# EAGLE board octanis_eps_v2 (EAGLE 7.2.0)
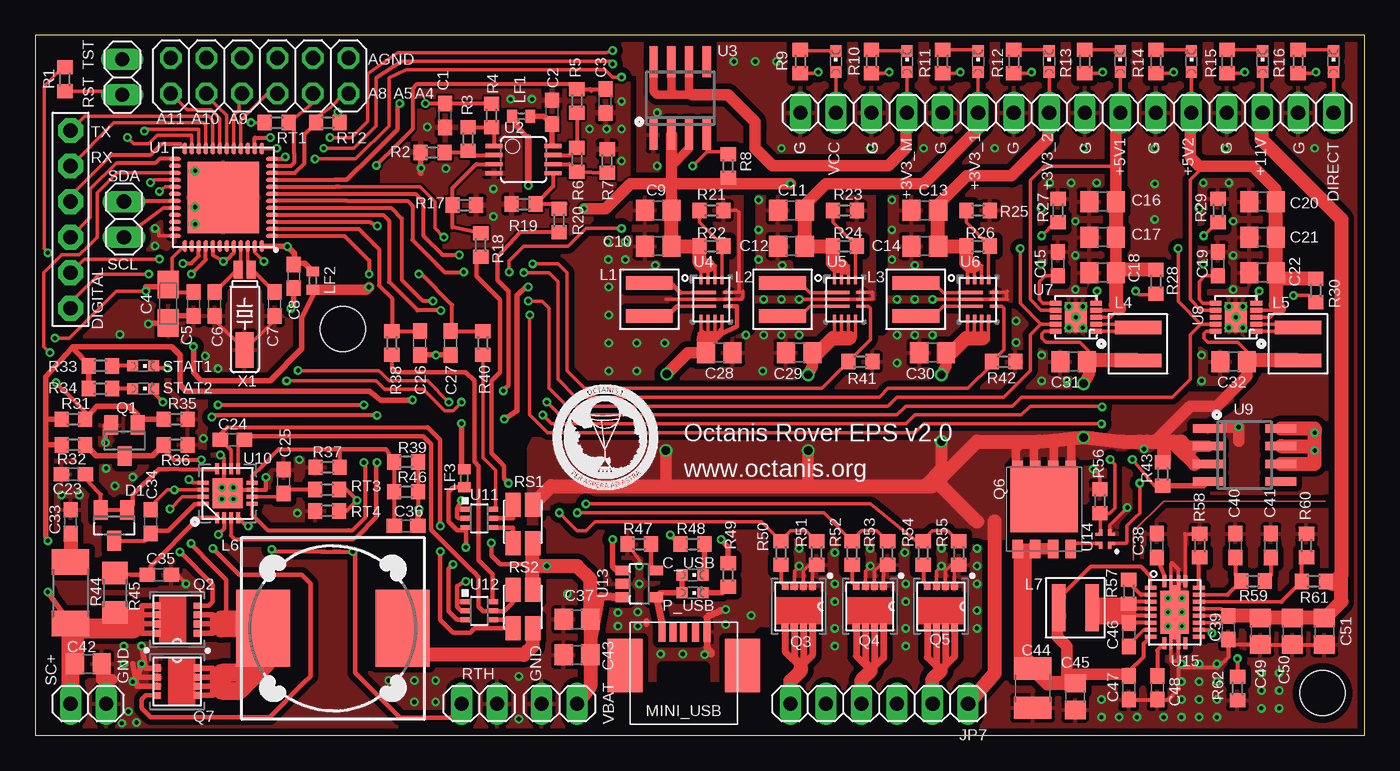
[diagram p2: board, top side]
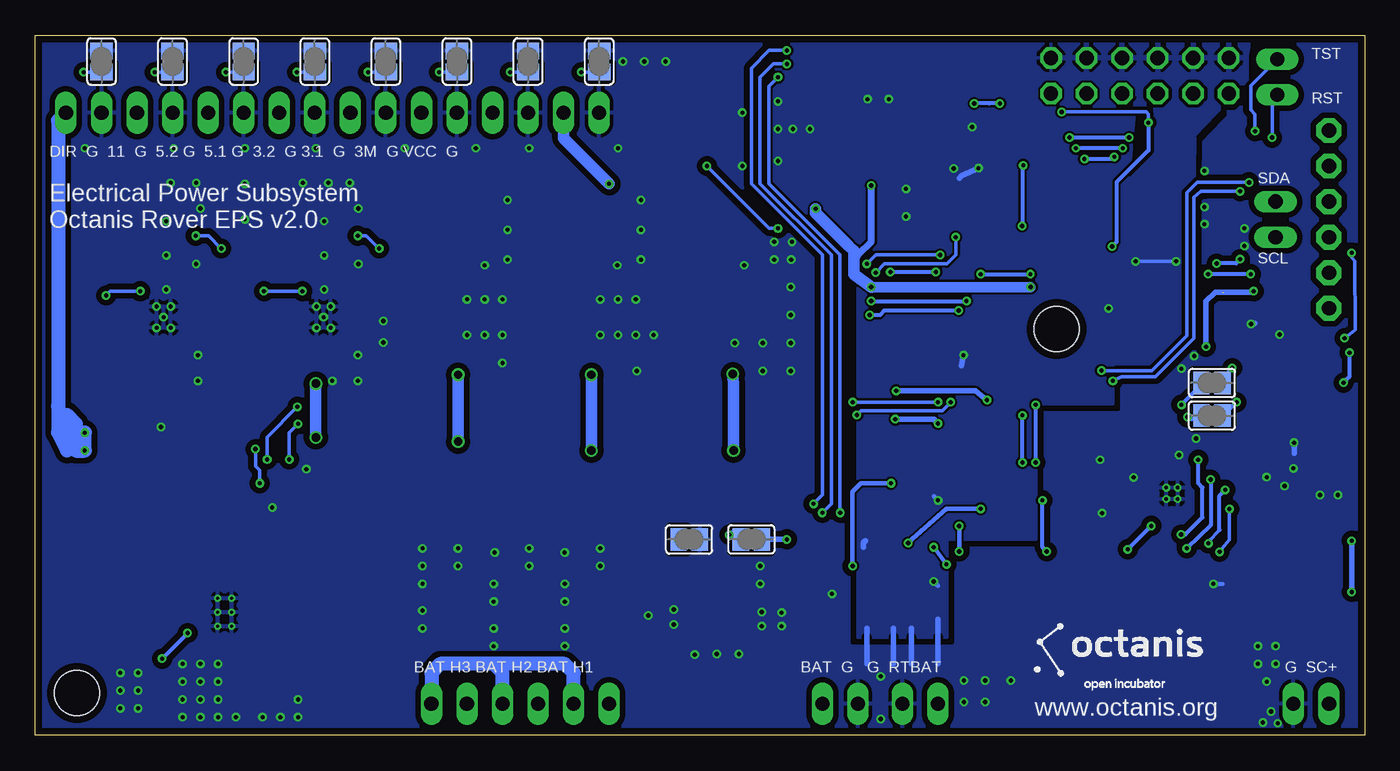
[diagram p3: board, bottom side, seen from below]

Size 95 x 50 mm. Coordinates in mm from the lower left corner, seen from the top.
Outline: 0,0 95,0 95,50 0,50 0,0
Copper layers (1*16): Top 0.035mm / dielectric 1.6mm / Bottom 0.035mm
Design rules "Elecrow_2-layer_PCB_eagle_rule": minimum track width 6mil, minimum drill 12mil, track to track 6mil, track to pad 6mil, pad to pad 6mil, via to via 8mil, smd to smd 0mil, copper to edge 20mil, drill to drill 10mil, minimum pad ring 6mil, minimum via ring 6mil, stop-mask expansion 0mil, vias tented up to drill 100mil, thermal gap 10mil
Net classes: 0 default: clearance 0.152 mm; 1 power: width 0.203 mm, drill 0.305 mm, clearance 0.152 mm; 3 fine: width 0.406 mm, drill 0.61 mm, clearance 0.152 mm
Holes 3.2 mm at 22,29 92,3
tRestrict: 10 lines

## Footprints (pad centres in the part's own frame; a part is rotated, then mirrored left to right if it is on the bottom)
CHIPLED_0603 = smd 0.8 x 0.8: A 0,-0.75; C 0,0.75
C0603 = smd 1.1 x 1: 1 -0.85,0; 2 0.85,0
A/3216-18R = smd 1.95 x 1.5: + 1.375,0; - -1.375,0
C0805 = smd 1.3 x 1.5: 1 -0.95,0; 2 0.95,0
C1210 = smd 1.6 x 2.7: 1 -1.4,0; 2 1.4,0
SOT23 = smd 1 x 1.4: 1 -0.95,-1.1; 2 0.95,-1.1; 3 0,1.1
1X06-BIG = drill 1.016 pad 1.778 octagon: 1 -6.35,0; 2 -3.81,0; 3 -1.27,0; 4 1.27,0; 5 3.81,0; 6 6.35,0
SJ = smd 1.168 x 1.6: 1 -0.762,0; 2 0.762,0
1X02 = drill 1.016 long: 1 -1.27,0; 2 1.27,0
2X06 = drill 1.016 octagon: 1 -6.35,-1.27; 2 -6.35,1.27; 3 -3.81,-1.27; 4 -3.81,1.27; 5 -1.27,-1.27; 6 -1.27,1.27; 7 1.27,-1.27; 8 1.27,1.27; 9 3.81,-1.27; 10 3.81,1.27; 11 6.35,-1.27; 12 6.35,1.27
1X16 = drill 1.016 long: 1 -19.05,0; 2 -16.51,0; 3 -13.97,0; 4 -11.43,0; 5 -8.89,0; 6 -6.35,0; 7 -3.81,0; 8 -1.27,0; 9 1.27,0; 10 3.81,0; 11 6.35,0; 12 8.89,0; 13 11.43,0; 14 13.97,0; 15 16.51,0; 16 19.05,0
1X06 = drill 1.016 long: 1 -6.35,0; 2 -3.81,0; 3 -1.27,0; 4 1.27,0; 5 3.81,0; 6 6.35,0
XFL4020 = smd 0.965 x 3.353: P$1 -1.181,0; P$2 1.181,0
DR127 = smd 3.85 x 5.5: 1 -4.975,0; 2 4.975,0
0402 = smd 0.7 x 0.9: 1 -0.65,0; 2 0.65,0
UX60SC-MB-5ST = smd 1.4 x 0.5: 1 6.1,1.55; 2 6.1,0.75; 3 6.1,0; 4 6.1,-0.85; 5 6.1,-1.65 | smd 3.8 x 2.5: M3 3.7,4.2; M4 3.7,-4.2
DQG8 = smd 0.559 x 0.508: 1 -1.47,0.975; 2 -1.47,0.325; 3 -1.47,-0.325; 5 1.47,-0.975; 6 1.47,-0.325; 7 1.47,0.325; 8 1.47,0.975 | smd 0.559 x 0.457: 4 -1.47,-0.975
PG-TDSON-8 = smd 1.3 x 0.75: 1 -2.825,1.905; 2 -2.825,0.635; 3 -2.825,-0.635; 4 -2.825,-1.905; 5 2.825,-1.905; 6 2.825,-0.635; 7 2.825,0.635; 8 2.825,1.905 | smd 4.7 x 4.8: TH 0.725,0
R0603 = smd 1 x 1.1: 1 -0.85,0; 2 0.85,0
R2010 = smd 1.8 x 2.7: 1 -2.2,0; 2 2.2,0
R1206 = smd 1.6 x 1.803: 1 -1.422,0; 2 1.422,0
4PADS_RESISTOR = smd 1.727 x 1.1: I1 0,0; I2 2.751,0; V1 0,1.4; V2 2.751,1.4
S-PVQFN-N48 = smd 0.85 x 0.28: 1 -3.475,2.75; 2 -3.475,2.25; 3 -3.475,1.75; 4 -3.475,1.25; 5 -3.475,0.75; 6 -3.475,0.25; 7 -3.475,-0.25; 8 -3.475,-0.75; 9 -3.475,-1.25; 10 -3.475,-1.75; 11 -3.475,-2.25; 12 -3.475,-2.75; 25 3.475,-2.75; 26 3.475,-2.25; 27 3.475,-1.75; 28 3.475,-1.25; 29 3.475,-0.75; 30 3.475,-0.25; 31 3.475,0.25; 32 3.475,0.75; 33 3.475,1.25; 34 3.475,1.75; 35 3.475,2.25; 36 3.475,2.75 | smd 0.28 x 0.85: 13 -2.75,-3.475; 14 -2.25,-3.475; 15 -1.75,-3.475; 16 -1.25,-3.475; 17 -0.75,-3.475; 18 -0.25,-3.475; 19 0.25,-3.475; 20 0.75,-3.475; 21 1.25,-3.475; 22 1.75,-3.475; 23 2.25,-3.475; 24 2.75,-3.475; 37 2.75,3.475; 38 2.25,3.475; 39 1.75,3.475; 40 1.25,3.475; 41 0.75,3.475; 42 0.25,3.475; 43 -0.25,3.475; 44 -0.75,3.475; 45 -1.25,3.475; 46 -1.75,3.475; 47 -2.25,3.475; 48 -2.75,3.475 | smd 5.1 x 5.1: VSS_QFN 0,0
MSOP08 = smd 0.3 x 1.2: 1 -0.976,-2.113; 2 -0.326,-2.113; 3 0.324,-2.113; 4 0.974,-2.113; 5 0.974,2.112; 6 0.324,2.112; 7 -0.326,2.112; 8 -0.976,2.112
SO8 = smd 0.6 x 2.2: 1 -1.905,-2.6; 2 -0.635,-2.6; 3 0.635,-2.6; 4 1.905,-2.6; 5 1.905,2.6; 6 0.635,2.6; 7 -0.635,2.6; 8 -1.905,2.6
RNC0014A = smd 1.778 x 0.229: 1 -0.555,0.49; 2 -0.555,0; 3 -0.555,-0.49 | smd 0.229 x 0.61: 4 -0.75,-1.4; 5 -0.25,-1.4; 6 0.25,-1.4; 7 0.75,-1.4; 11 0.75,1.4; 12 0.25,1.4; 13 -0.25,1.4; 14 -0.75,1.4 | smd 0.61 x 0.229: 8 1.15,-0.5; 9 1.15,0; 10 1.15,0.5
S-PVSON-N10 = smd 0.28 x 0.825: 1 -1,-1.462; 2 -0.5,-1.462; 3 0,-1.462; 4 0.5,-1.462; 5 1,-1.462; 6 1,1.462; 7 0.5,1.462; 8 0,1.462; 9 -0.5,1.462; 10 -1,1.462 | smd 2.15 x 1.6: EXPAD 0,0 | drill 0.3 pad 0.605: GND1 -0.762,0.508 | drill 0.3 pad 0.61: GND2 -0.762,-0.508; GND3 0,0; GND4 0.762,-0.508 | drill 0.305 pad 0.605: GND5 0.762,0.508
RVA16_2P14X2P14 = smd 0.787 x 0.279: 1 -1.75,0.75; 2 -1.75,0.25; 3 -1.75,-0.25; 4 -1.75,-0.75; 9 1.75,-0.75; 10 1.75,-0.25; 11 1.75,0.25; 12 1.75,0.75 | smd 0.279 x 0.787: 5 -0.75,-1.75; 6 -0.25,-1.75; 7 0.25,-1.75; 8 0.75,-1.75; 13 0.75,1.75; 14 0.25,1.75; 15 -0.25,1.75; 16 -0.75,1.75 | smd 2.134 x 2.134: 17 0,0 | drill 0.254: V -0.406,-0.406; V_1 -0.406,0.406; V_2 0.406,-0.406; V_3 0.406,0.406
SC70-6 = smd 0.35 x 0.8: 1 -0.65,-0.95; 2 0,-0.95; 3 0.65,-0.95; 4 0.65,0.95; 5 0,0.95; 6 -0.65,0.95
SOT23-5 = smd 0.7 x 1: 1 0.95,1.2; 2 0,1.2; 3 -0.95,1.2; 4 -0.95,-1.2; 5 0.95,-1.2
QFN-4 = smd 0.23 x 0.49: P1 -0.325,0.45; P2 -0.325,-0.45; P3 0.325,-0.45; P4 0.325,0.45 | smd 0.49 x 0.23: P$1 -0.45,0.325; P$2 -0.45,-0.325; P$3 0.45,-0.325; P$4 0.45,0.325
R-PVQFN-N20 = smd 0.85 x 0.28: P$1 0,0; P$10 4.45,0; P$11 4.45,1.5; P$20 0,1.5 | smd 0.28 x 0.85: P$2 0.475,-0.975; P$3 0.975,-0.975; P$4 1.475,-0.975; P$5 1.975,-0.975; P$6 2.475,-0.975; P$7 2.975,-0.975; P$8 3.475,-0.975; P$9 3.975,-0.975; P$12 3.975,2.475; P$13 3.475,2.475; P$14 2.975,2.475; P$15 2.475,2.475; P$16 1.975,2.475; P$17 1.475,2.475; P$18 0.975,2.475; P$19 0.475,2.475 | smd 3.05 x 2.05: PGND1 2.225,0.75 | smd 1.15 x 0.23: PGND2 0.15,1.025; PGND3 0.15,0.475; PGND4 4.3,0.475; PGND5 4.3,1.025 | smd 3.85 x 0.78: PGND6 2.225,0.75 | drill 0.2 pad 0.4: PGND7 2.225,0.25; PGND8 1.225,0.25; PGND9 1.225,1.25; PGND10 2.225,1.25; PGND11 3.225,0.25; PGND12 3.225,1.25
MS3V-T1R = smd 0.635 x 1.27: P1 -0.47,-4.43; P2 0.47,-4.43 | smd 1.27 x 2.54: P3 0,1.3

## Placement (x,y rotation side)
+3V3_1  3V3-1  [CHIPLED_0603]  67.39,48.11 0 top
+3V3_2  3V3-2  [CHIPLED_0603]  72.47,48.11 0 top
+3V3_M  3V3-M  [CHIPLED_0603]  62.31,48.11 0 top
+5V1  5V1  [CHIPLED_0603]  77.55,48.11 0 top
+5V2  5V2  [CHIPLED_0603]  82.63,48.11 0 top
+11V  11V  [CHIPLED_0603]  87.71,48.11 0 top
C1  1.5uF  [C0603]  29.3,44.26 90 top
C2  100nF  [C0603]  36.93,44.49 270 top
C3  1.5uF  [C0603]  40.75,45.29 90 top
C4  10uF  [A/3216-18R]  9.52,30.8 90 top
C5  100nF  [C0603]  11.33,30.78 270 top
C6  12pF  [C0603]  12.85,30.78 90 top
C7  12pF  [C0603]  17.12,30.78 90 top
C8  100nF  [C0603]  18.49,32.77 270 top
C9  22uF  [C0805]  44.53,37.47 180 top
C10  22uF  [C0805]  44.53,34.92 180 top
C11  22uF  [C0805]  54.05,37.47 180 top
C12  22uF  [C0805]  54.05,34.92 180 top
C13  22uF  [C0805]  63.58,37.47 180 top
C14  22uF  [C0805]  63.58,34.92 180 top
C15  10nF  [C0603]  73.11,33.66 90 top
C16  22uF  [C0805]  76.28,38.1 180 top
C17  22uF  [C0805]  76.28,35.56 180 top
C18  22uF  [C0805]  76.28,33.02 180 top
C19  10nF  [C0603]  84.53,33.66 90 top
C20  22uF  [C0805]  87.71,38.1 180 top
C21  22uF  [C0805]  87.71,35.56 180 top
C22  22uF  [C0805]  87.71,33.02 180 top
C23  1uF  [C0603]  2.74,18.62 180 top
C24  100nF  [C0603]  14.11,21.09 180 top
C25  1uF  [C0603]  17.76,18.1 90 top
C26  1.5uF  [C0603]  27.5,28 90 top
C27  1.5uF  [C0603]  29.7,28 90 top
C28  10uF  [C0805]  48.9,27.3 0 top
C29  10uF  [C0805]  54.61,27.3 180 top
C30  10uF  [C0805]  64.14,27.3 180 top
C31  22uF  [C0805]  74.22,26.67 180 top
C32  22uF  [C0805]  85.64,26.67 180 top
C33  2.2uF  [C0603]  2.54,15.24 90 top
C34  100nF  [C0603]  8.26,15.24 270 top
C35  1uF  [C0603]  8.89,11.43 0 top
C36  22pF  [C0603]  26.52,14.94 180 top
C37  10uF  [C0805]  38.73,8.26 180 top
C38  2.2uF  [C0603]  80.17,13.53 90 top
C39  1uF  [C0603]  85.27,7.66 90 top
C40  150pF  [C0603]  85.77,13.53 90 top
C41  4.7nF  [C0603]  88.31,13.53 90 top
C42  10uF  [C0805]  3.81,5.08 180 top
C43  10uF  [C0805]  38.73,5.71 180 top
C44  47uF Tantal  [C1210]  71.29,3.35 270 top
C45  10uF  [C0805]  74.34,2.74 270 top
C46  100nF  [C0603]  78.15,7.16 270 top
C47  100nF  [C0603]  78.15,3.37 270 top
C48  47nF  [C0603]  80.19,3.37 270 top
C49  22uF  [C0805]  87.56,7.41 90 top
C50  22uF  [C0805]  89.85,7.41 90 top
C51  22uF  [C0805]  92.14,7.41 90 top
C_USB  C_USB  [CHIPLED_0603]  46.99,11.43 270 top
D1  BAT54C  [SOT23]  5.66,14.98 180 top
DIGITAL  [1X06-BIG]  2.54,36.83 90 top
DIRECT  DIRECT  [CHIPLED_0603]  92.79,48.11 0 top
J100  [SJ]  48.26,13.97 0 bottom
J101  [SJ]  43.81,13.97 180 bottom
J102  [SJ]  10.9,22.81 0 bottom
J103  [SJ]  10.9,25.15 0 bottom
J104  [SJ]  90.25,48.11 270 bottom
J105  [SJ]  85.17,48.11 270 bottom
J106  [SJ]  80.09,48.11 270 bottom
J107  [SJ]  75.01,48.11 270 bottom
J108  [SJ]  69.93,48.11 270 bottom
J109  [SJ]  64.85,48.11 270 bottom
J110  [SJ]  59.77,48.11 270 bottom
J111  [SJ]  54.69,48.11 270 bottom
JP1  [1X02]  6.23,47 90 top
JP2  [2X06]  16.05,47.09 0 top
JP3  [1X16]  73.74,44.45 0 top
JP4  [1X02]  6.35,36.83 270 top
JP5  [1X02]  3.81,2.24 180 top
JP6  [1X02]  37.47,2.24 0 top
JP7  [1X06]  60.33,2.24 180 top
L1  1uH  [XFL4020]  43.9,31.11 90 top
L2  1uH  [XFL4020]  53.42,31.11 90 top
L3  1uH  [XFL4020]  62.95,31.11 90 top
L4  1uH  [XFL4020]  78.82,27.94 90 top
L5  1uH  [XFL4020]  90.25,27.94 90 top
L6  DR127_6u8  [DR127]  21.29,7.62 0 top
L7  1.5uH  [XFL4020]  74.34,9.09 0 top
LF1  100mH  [0402]  34.75,44.2 180 top
LF2  100mH  [0402]  19.86,32.46 270 top
LF3  100mH  [0402]  30.68,18.34 90 top
MINI_USB  UX60SC-MB-5ST  [UX60SC-MB-5ST]  46.35,1.27 90 top
P_USB  P_USB  [CHIPLED_0603]  46.99,10.16 270 top
Q1  BSS123  [SOT23]  6.4,21.03 180 top
Q2  CSD16327Q3_DQG_8  [DQG8]  10.16,8.26 180 top
Q3  CSD16327Q3_DQG_8  [DQG8]  54.58,9.19 270 top
Q4  CSD16327Q3_DQG_8  [DQG8]  59.66,9.19 270 top
Q5  CSD16327Q3_DQG_8  [DQG8]  64.73,9.19 270 top
Q6  BSC0901NS  [PG-TDSON-8]  72.11,16.11 90 top
Q7  CSD16327Q3_DQG_8  [DQG8]  10.16,3.81 0 top
R1  10k  [R0603]  2.13,46.83 90 top
R2  200k (0.1%)  [R0603]  28.41,41.61 180 top
R3  100k (0.1%)  [R0603]  30.95,42.57 270 top
R4  1k  [R0603]  32.62,44.26 270 top
R5  1k  [R0603]  38.72,45.29 270 top
R6  100k (0.1%)  [R0603]  38.72,41.1 270 top
R7  330k (0.1%)  [R0603]  40.89,41 90 top
R8  1M  [R0603]  49.53,40.64 270 top
R9  1k  [R0603]  54.69,48.11 90 top
R10  1k  [R0603]  59.77,48.11 90 top
R11  1k  [R0603]  64.85,48.11 90 top
R12  1k  [R0603]  69.93,48.11 90 top
R13  1.5k  [R0603]  75.01,48.11 90 top
R14  1.5k  [R0603]  80.09,48.11 90 top
R15  4.7k  [R0603]  85.17,48.11 90 top
R16  1.5k  [R0603]  90.25,48.11 90 top
R17  100k (0.1%)  [R0603]  30.67,37.85 180 top
R18  200k (0.1%)  [R0603]  31.85,35 270 top
R19  100k (0.1%)  [R0603]  34.91,37.92 0 top
R20  330k (0.1%)  [R0603]  37.45,36.75 270 top
R21  150k  [R0603]  48.34,37.47 180 top
R22  360k  [R0603]  48.34,34.92 180 top
R23  150k  [R0603]  57.87,37.47 180 top
R24  360k  [R0603]  57.87,34.92 180 top
R25  150k  [R0603]  67.39,37.47 180 top
R26  360k  [R0603]  67.39,34.92 180 top
R27  1M  [R0603]  73.11,37.47 270 top
R28  1M  [R0603]  80.09,32.38 90 top
R29  1M  [R0603]  84.53,37.47 270 top
R30  1M  [R0603]  91.52,31.75 90 top
R31  dnp  [R0603]  2.74,22.56 180 top
R32  Rmpph  [R0603]  2.74,20.73 180 top
R33  4k7  [R0603]  4.67,26.37 180 top
R34  4k7  [R0603]  4.67,24.74 180 top
R35  1M  [R0603]  10.06,22.56 180 top
R36  Rmppl  [R0603]  10.06,20.73 180 top
R37  100k (1%)  [R0603]  20.9,19.12 0 top
R38  1k  [R0603]  25.5,28 270 top
R39  100k (1%)  [R0603]  26.52,19.51 0 top
R40  1k  [R0603]  32,28 270 top
R41  1M  [R0603]  58.98,26.67 0 top
R42  1M  [R0603]  69.22,26.67 0 top
R43  1M  [R0603]  80.57,18.64 90 top
R44  2  [R2010]  2.54,10.16 270 top
R45  10  [R1206]  5.71,10.16 90 top
R46  2.2M (1%)  [R0603]  26.52,17.37 0 top
R47  2k  [R0603]  43.18,13.64 180 top
R48  470  [R0603]  46.99,13.64 180 top
R49  1k  [R0603]  49.53,11.43 90 top
R50  1k  [R0603]  53.3,13 90 top
R51  1M  [R0603]  55.84,13 270 top
R52  1k  [R0603]  58.38,13 90 top
R53  1M  [R0603]  60.92,13 270 top
R54  1k  [R0603]  63.47,13 90 top
R55  1M  [R0603]  66,13 270 top
R56  1M  [R0603]  76.09,16.71 270 top
R57  47k  [R0603]  78.15,10.24 270 top
R58  100k  [R0603]  83.23,13.53 270 top
R59  150-220k  [R0603]  87.04,10.99 180 top
R60  56k  [R0603]  90.85,13.53 270 top
R61  430k  [R0603]  91.37,10.97 0 top
R62  dnp  [R0603]  85.92,3.32 270 top
RS1  10m  [4PADS_RESISTOR]  35.56,13.7 90 top
RS2  10m  [4PADS_RESISTOR]  35.56,7.62 90 top
RT1  2723  [R0603]  17.27,43.74 0 top
RT2  2723  [R0603]  20.93,43.74 180 top
RT3  2696  [R0603]  20.88,17.53 0 top
RT4  8187  [R0603]  20.88,16 180 top
RTH  103AT  [1X02]  31.75,2.24 180 top
STAT1  5V-ok  [CHIPLED_0603]  7.73,26.37 270 top
STAT2  5V-ok  [CHIPLED_0603]  7.73,24.74 270 top
U1  MSP430FR5969  [S-PVQFN-N48]  13.46,38.4 180 top
U2  OPA2333DGK  [MSOP08]  34.91,41.1 270 top
U3  TPS2022D  [SO8]  46.1,45.49 0 top
U4  Value  [RNC0014A]  48.34,31.11 0 top
U5  Value  [RNC0014A]  57.87,31.11 0 top
U6  Value  [RNC0014A]  67.39,31.11 0 top
U7  TPS61232  [S-PVSON-N10]  74.38,29.84 90 top
U8  TPS61232  [S-PVSON-N10]  85.81,29.84 90 top
U9  TPS2022D  [SO8]  86.42,20 270 top
U10  BQ24650_RVA_16  [RVA16_2P14X2P14]  13.76,17.26 90 top
U11  INA213  [SC70-6]  31.75,15.47 270 top
U12  INA213  [SC70-6]  31.75,8.87 270 top
U13  MCP73831/2  [SOT23-5]  43.18,10.79 90 top
U14  MIC5019  [QFN-4]  76.46,14.01 180 top
U15  TPS61088  [R-PVQFN-N20]  80.69,10.99 270 top
VCC  3V3-EPS  [CHIPLED_0603]  57.23,48.11 0 top
X1  32.768kHz  [MS3V-T1R]  14.99,28.8 180 top

## Tracks (layer width: path | path; a pad name or v marks a point on that pad's centre or on a via)
+3V3  (via drill 0.3)  (1 unrouted)
  Top 0.254: R1.2 1.97,47.69 0.66,46.33 0.66,34.75 v0.91,34.44 | v1.42,28.35 2.44,28.35 4.57,30.48 5.79,31.7 v7.92,31.7 | C9.1 C10.1 46.99,34.92 | R22.2 46.99,34.92 | 47.59,33.66 U4.14 47.59,33.42 47.7,33.53 | 47.59,33.66 47.59,34.33 46.99,34.92 | 47.59,33.66 48.09,33.16 U4.13 48.09,33.53 48.4,33.31 48.5,33.2 48.59,33.2 | 47.59,33.66 48.26,33.66 48.59,33.33 U4.12 48.59,33.2 | VCC.A JP3.2 | U1.37 10.65,34.93 9.8,34.09 9.8,32.45 C4.+ 9.35,32 | 10.06,31.64 | 10.06,31.64 10.01,31.64 | 10.06,31.64 | 10.06,31.64 9.96,31.64 | 10.06,31.64 | 48.59,33.2 48.59,33.5 48.62,33.53
  Top 0.3: v35.25,32 35.1,32 | 9.99,31.71 10.06,31.64 C5.1
  Top 0.406: LF2.2 20.93,31.81 21.54,31.83 21.54,31.75 20.03,31.73 | 35.25,42.67 35.2,42.67 34.44,43.43 34.44,43.85 LF1.2 | 20.37,31.7 20.03,31.73 | v11.33,27.74 11.33,25.86 11.89,25.3 14.94,25.3 16.79,25.3 19.07,27.57 19.07,29.76 20.03,31.73 | v7.92,31.7 7.92,32 9.35,32 | v35.25,32 35.05,32 34.44,31.39 34.44,23.47 | 34.44,23.47 34.44,23.16 | 34.44,23.16 34.44,23.47 | v30.48,22.25 30.48,20.12 30.48,19.09 LF3.2 | 34.44,23.47 34.44,23.16 | 34.44,23.16 v33.53,22.55
  Top 0.5: v35.25,39.25 35.25,42.67
  Top 0.61: U3.3 46.73,41.9 45.48,40.64
  Top 0.75: v23.86,32 23.68,31.81 20.93,31.81 LF2.2
  Top 0.813: C9.1 45.48,39.37 | 45.48,39.37 45.48,40.64 45.48,42.24 U3.2 | v39.22,37.59 40.77,37.59 42.55,39.37 45.48,39.37 | v53.98,39.37 49.53,39.37 | 49.53,39.37 45.48,39.37 | R8.2 49.53,39.37
  Top 1.016: 48.09,33.53 47.7,33.53 47.49,33.74 R22.2 C10.1 C9.1
  Bottom 0.254: v0.91,34.44 0.91,34.14 0.71,33.83 0.66,28.96 v1.42,28.35 | 10.67,31.64 10.11,31.64
  Bottom 0.406: v11.33,27.74 11.33,30.97 10.67,31.64 10.11,31.64 7.99,31.64 v7.92,31.7 | v30.48,22.25 30.79,22.55 v33.53,22.55
  Bottom 0.5: 35.25,35.25 v35.25,39.25
  Bottom 0.508: 35.25,35.25 35.25,35.23 36.2,34.29 36.5,33.66
  Bottom 0.75: v23.86,32 33.66,32 v35.25,32
  Bottom 0.813: v53.98,39.37 57.23,42.62 JP3.2 | v39.22,37.59 39.22,37.31 36.83,34.92 36.5,34.59 36.5,33.66 36.5,32.91 v35.25,32
+3V3_1
  Top 0.254: 57.15,33.66 57.62,33.19 U5.13 57.62,33.02 | 57.15,33.66 57.12,33.62 U5.14 57.12,33.42 57.23,33.53 | 57.15,33.66 57.78,33.66 58.12,33.33 U5.12 58.12,33.2 | 57.15,33.66 57.15,34.79 R24.2 C12.1 C11.1 | +3V3_1.A JP3.6 | 57.62,33.02 57.62,33.53 57.92,33.31 | 58.12,33.2 58.12,33.5 58.14,33.53 | 58.12,33.2 57.94,33.02 57.62,33.02
  Top 0.813: JP3.6 67.31,44.37 67.31,43.81 | 67.31,43.81 67.31,43.18 | C11.1 55.01,37.86 56.52,39.37 57.15,39.37 63.5,39.37 67.31,43.18 | 67.31,43.18 67.31,43.81
  Top 1.016: 57.62,33.53 57.23,33.53 57.02,33.74 R24.2 C12.1 C11.1
+3V3_2
  Top 0.254: U6.14 66.64,33.42 66.75,33.53 | U6.13 67.14,33.53 67.44,33.31 67.53,33.31 67.64,33.2 | U6.12 67.64,33.2 | 67.64,33.2 67.64,33.5 67.67,33.53 | +3V3_2.A JP3.8
  Top 0.813: JP3.8 72.39,44.37 72.39,42.55 69.77,39.93 66.6,39.93 64.53,37.86 C13.1
  Top 1.016: 67.14,33.53 66.75,33.53 66.54,33.74 R26.2 C14.1 C13.1
+3V3_M
  Top 0.254: +3V3_M.A JP3.4
  Top 0.61: U3.8 44.2,45.98 44.45,45.72 45.72,45.72 | 45.72,45.72 46.99,45.72 46.73,45.98 U3.6 | U3.7 45.47,45.98 45.72,45.72
  Top 0.813: 46.99,45.72 49.53,45.72 51.44,43.81 51.44,43.18 51.44,41.91 52.68,40.66 58.45,40.66 60.98,40.66 62.23,41.91 62.23,44.37 JP3.4
+5V_1
  Top 0.254: U7.3 76.83,29.84 77.47,30.48 77.33,30.34 U7.4 | U7.7 71.89,30.34 71.12,31.11 71.12,39.62 72.11,40.62 77.23,40.62 | +5V1.A JP3.10
  Top 0.813: JP3.10 77.23,44.13 77.23,40.62 C16.1 C17.1 C18.1
  Top 1.016: 77.47,30.48 77.23,30.72 C18.1 77.44,33.23 R28.2 | C16.1 C17.1
+5V_2
  Top 0.254: U8.3 88.27,29.84 88.9,30.48 88.77,30.34 U8.4 | U8.7 83.32,30.34 82.55,31.11 82.55,39.67 83.5,40.63 | +5V2.A 82.63,43.9 82.55,43.81
  Top 0.813: JP3.12 82.55,44.37 82.55,43.81 82.55,41.27 83.21,40.62 | 83.21,40.62 83.5,40.63 83.21,40.62 | 83.21,40.62 87.02,40.62 88.66,38.98 C20.1
  Top 1.016: C22.1 88.66,30.72 88.9,30.48 | C22.1 C21.1 C20.1 | R30.2 89.08,32.6 C22.1
+12V
  Top 0.25: U15.P$16 84.76,9.02 | U15.P$14 84.77,8.02 | U15.P$15 C39.2
  Top 0.254: +11V.A JP3.14
  Top 0.3: 84.76,9.02 C39.2 | 84.77,8.02 C39.2 | C39.2
  Top 1: C51.2 C50.2 C49.2 87.41,8.51 C39.2
  Top 1.016: JP3.14 87.63,44.37 87.63,42.55 93.34,36.83 93.34,11.43 | 93.34,11.43 92.71,10.79 92.53,10.97 R61.2 | 93.34,11.43 93.34,9.53 92.22,8.4 92.18,8.36 C51.2
A_EXT0
  Top 0.25: 22.1,45.82 21.08,44.81 20.08,44.11 RT2.2
  Top 0.254: JP2.11 22.1,45.82
  Top 0.3: U1.10 17.5,40.16 18.57,40.16 19.25,40.84 19.25,41.45 19.25,42.91 RT2.2
A_EXT1
  Top 0.25: 19.86,45.17 18.52,44.07 RT1.2
  Top 0.254: 19.86,45.17 JP2.9
  Top 0.3: 18.52,44.07 18.52,41.48 18.52,40.88 18.34,40.69 18.3,40.66 U1.11
A_EXT2
  Top 0.254: U1.16 14.71,43.92 15.42,44.63 16.61,45.82 JP2.7
A_EXT3
  Top 0.254: U1.17 14.21,44.26 14.58,44.63 14.58,45.62 JP2.5
A_EXT4
  Top 0.254: U1.18 13.71,44.25 13.11,44.86 12.24,45.72 JP2.3
A_EXT5
  Top 0.254: U1.19 13.21,44.04 12.6,44.65 10.87,44.65 JP2.1
AGND  (via drill 0.3)
  Top 0.25: U1.47 15.71,34.48 16.05,34.14 v16.36,33.83
  Top 0.3: U1.41 12.71,34.28 v13.46,33.83 13.31,33.98 13.77,33.98 14.21,34.43 U1.44
  Top 0.305: U11.2 30.25,15.47 30.18,15.54 30.18,16.15 | 30.77,16.15 U11.1 30.21,16.12 30.18,16.15 | 30.18,16.15 v30.48,16.76 | U12.2 30.75,8.87 30.45,8.87 30.18,9.14 30.18,9.45 30.25,9.52 | v30.79,10.97 30.19,10.65 30.18,10.64 30.18,10.06 30.18,9.52 30.25,9.52 | 30.25,9.52 U12.1
  Top 0.406: C8.2 18.49,30.79 v18.29,30.48 | C27.1 28.83,27.15 v28.65,27.13 28.78,27.15 C26.1 | R2.2 27.56,40.13 v27.58,40.49
  Bottom 0.25: v16.36,33.83 13.92,33.83 v13.46,33.83
  Bottom 0.305: v30.48,16.76 30.79,17.07 | v30.79,10.97 30.48,10.67
  Bottom 0.406: 35.81,13.41 35.81,13.72 35.66,13.87 | v28.65,27.13 28.8,26.36 | v27.58,40.49 28.8,39.93 28.96,39.78 | 30.48,6.99 30.48,7.62 30.48,8.26 | 32.38,7.62 32.38,6.99 | 33.66,7.62 33.66,6.99 | 35.56,7.62 35.56,6.99
  other vias: 29.36,40.46 28.04,43.43 33.99,45.42 41.91,45.26 41.91,43.28 41.91,41 35.51,45.42 32.77,39.01 32.77,37.03 39.62,43.28 40.84,43.28
  pour Bottom (isolate 0.254): 12.42,29.03 17.75,24.16 17.88,40.84 21.49,45.72 21.49,49.68 8.23,49.68 8.43,48.62 8.43,46.79 12.22,42.85 12.19,42.57
  pour Bottom: 18.03,34.14 24.54,34.14 36.2,34.92 36.2,6.99 29.84,6.99 29.84,13.97 23.5,13.97 23.5,23.67 17.98,23.67
  pour Bottom: 17.42,33.22 35.97,33.22 42.21,39.62 42.21,49.07 41.61,49.68 16,49.68 17.27,34.59 17.88,33.99
  pour Top: 24.84,47.85 24.84,39.01 28.96,34.9 37.8,34.9 42.37,39.47 42.37,49.07 42.06,49.38 26.21,49.38 24.84,48.01
AVCC  (via drill 0.3)
  Top 0.25: RT1.1 v15.44,43.74 | U1.48 16.39,34.9 | RT2.1 21.64,44.26 v21.64,44.5
  Top 0.406: LF2.1 19.82,33.11 19.25,33.68 18.56,33.68 | 18.56,33.68 C8.1 | 18.56,33.68 18.56,34.38 v18.03,34.9 16.39,34.9
  Bottom 0.25: v21.64,44.5 21.69,44.5 15.6,44.5 15.44,44.35 v15.44,43.74
  Bottom 0.3: v15.44,43.74 15.44,41.76 17.73,39.47 17.73,35.2 v18.03,34.9
AVCC1  (via drill 0.3)
  Top 0.305: v30.79,13.41 30.8,13.73 U11.3 30.61,14.63 30.18,14.63 29.57,15.24 29.57,17.37 29.88,17.69 LF3.1 | v29.87,12.19 29.57,11.89 29.57,8.84 30.18,8.23 U12.3
  Bottom 0.305: v30.79,13.41 v29.87,12.19
AVCC2
  Top 0.406: LF1.1 36.38,44.2 C2.2 36.93,42.16 U2.8
BAT+  (via drill 0.3)
  Top 0.3: R18.2 31.55,33.85 | R39.2 R46.2 27.39,15.59 C36.1
  Top 0.305: 31.55,33.85 31.55,32.77 33.22,31.09 33.22,25.91 32.61,25.3 32.61,20.12 33.22,19.51 33.53,19.2 33.53,18.29 v33.83,17.98 | v36.58,12.06 35.69,12.06 35.56,12.19 | 35.26,12.19 33.22,12.19 32.61,12.8 v32.61,13.72
  Top 0.406: C36.1 27.39,15.59 v27.43,16.15 | 35.26,12.19 35.56,11.89
  Top 0.61: U13.3 40.46,9.9 C43.1
  Top 1.016: RS2.I2 35.56,11.89 35.56,12.06 | 35.56,12.06 35.56,12.19 RS1.I1 | 35.56,12.06 v36.58,12.06 38.73,12.06 39.69,11.12 C37.1 C43.1 39.69,3.49 JP6.2
  Bottom 0.305: v33.83,17.98 35.97,17.98 36.58,17.37 v36.58,12.06 | v27.43,16.15 29.87,16.15 v32.61,13.72
BAT_11V
  Top 0.3: C47.1 78.15,4.54 79.22,5.61 79.22,6.52 U15.P$9 | U15.P$2 79.71,11.36 79.06,12.01 75.41,12.01 73.27,9.87 | 73.27,8.57 L7.P$1
  Top 0.75: Q6.1 Q6.2 | Q6.2 Q6.3 Q6.2
  Top 0.813: 78.05,4.32 74.34,4.32 C45.1 | 73.07,8.26 73.07,8.36 73.07,9.67 73.27,9.87 | 73.07,8.26 73.07,7.02 73.74,6.35 73.74,3.69 | 73.27,8.57 73.27,8.46 73.07,8.26 | Q6.3 71.16,13.29 70.56,12.7
  Top 1: C45.1 73.74,3.69 72.35,3.69 C44.1 | 78.05,4.32 C47.1
  Top 1.27: 70.56,12.7 70.56,5.47 C44.1
BAT_OUT  (via drill 0.3, 0.6)
  Top 0.25: U14.P$1 U14.P1
  Top 0.254: 57,28.65 57.12,28.77 U5.4 57.12,28.38 57.15,28.35 | 57.61,28.65 57.62,28.66 U5.5 57.62,28.52 57.78,28.35 | U5.6 58.12,28.75 58.22,28.04 | 48.77,28.35 49.07,28.65 49.09,28.67 U4.7 49.09,29.07 48.69,28.68 48.59,28.75 U4.6 48.59,28.78 | U5.7 58.62,28.44 58.22,28.04 | 47.9,28.65 47.59,28.96 U4.4 47.59,28.77 47.47,28.65 | 48.03,28.6 48.09,28.66 U4.5 48.09,28.66 48.08,28.65 | 67.51,28.5 67.67,28.65 67.64,28.68 U6.6 67.64,28.75 67.74,28.04 | 67.51,28.5 67.36,28.35 67.14,28.57 | 67.51,28.5 67.97,28.04 68.14,28.21 U6.7 68.14,28.44 67.74,28.04 | U6.5 67.14,28.57 | U6.4 66.64,28.54 66.45,28.35 | 66.45,28.35 66.92,28.35 67.14,28.57 | 66.45,28.35 66.13,28.35 C30.1 | 58.22,28.35 58.22,28.04 | U14.P$1 77.39,13.68 78,13.68 78.03,13.72 78.03,14.94 78.64,15.54 | 75.25,26.76 75.25,27.46 74.68,28.04 72.24,28.04 71.93,28.35 71.93,28.65 72.13,28.84 U7.10 | 86.68,26.76 86.56,26.88 86.56,27.43 85.95,28.04 83.82,28.04 83.52,28.35 83.52,28.65 83.71,28.84 U8.10 | 78.64,15.54 78.94,15.85 | v79.25,20.42 79.25,20.65 78.94,20.95 | v78.94,17.98 78.94,15.85 | 78.94,15.85 78.64,15.54 | U9.3 82.87,19.36 | U6.4 66.64,28.77 66.52,28.65 | U6.5 67.14,28.66 67.13,28.65 | U6.4 66.64,28.46 66.33,28.16 | U6.5 67.14,28.43 67.06,28.35 | 67.74,28.04 67.74,28.27 67.67,28.35
  Top 0.305: 47.59,28.35 47.9,27.74 47.9,27.66 C28.1 48.09,27.45 48.09,28.35 47.9,28.54 47.9,28.65 48.03,28.6 48.5,28.44 | 48.59,28.78 48.46,28.65 48.46,28.47 48.5,28.44 | 49.09,28.67 49.07,28.65 | 49.07,28.65 48.77,28.35 | 48.77,28.35 48.5,28.44 | U4.8 50.16,30.61 50.16,30.48 50.16,29.21 48.9,28.57 49.07,28.65 | 49.07,28.65 48.77,28.35 | 47.78,28.35 47.47,28.65 | 48.09,28.66 48.09,28.41 48.16,28.35 | 48.36,28.35 48.69,28.68
  Top 0.406: 74.07,19.34 74.01,19.29 Q6.5 | 72.8,19.34 72.74,19.29 Q6.6 | 71.37,19.04 Q6.7
  Top 0.61: 71.75,20.95 70.64,20.95 70.1,20.42 70.1,19.04 Q6.8 | 74.07,20.73 74.07,19.34 | 72.8,20.73 72.8,19.34 | 71.37,20.42 71.37,19.04
  Top 0.813: v45.09,20.32 45.09,17.78 | C29.1 55.56,26.35 v55.24,25.73 | v55.24,20.32 55.24,17.78 | C30.1 65.08,26.35 v64.77,25.73 | v64.77,20.95 64.77,19.05 63.5,17.78 | C31.1 75.33,25.8 v74.93,25.09 | v74.93,21.26 71.75,20.95 | C32.1 86.59,25.64 86.36,25.4 84.45,23.5 82.55,23.5 80.01,20.95 | 47.9,28.04 47.9,27.74 | U9.2 82.23,20.63 81.92,20.32 | C28.1 46.66,27.3 v45.14,25.78
  Top 1.016: RS1.I2 36.89,17.78 45.09,17.78 55.24,17.78 63.5,17.78 64.14,17.78 67.31,20.95 71.75,20.95 v74.93,21.26 77.72,20.95 78.94,20.95 79.45,20.95 80.01,20.95 80.64,20.95 | 67.31,15.24 64.77,17.78 | 80.64,20.95 81.28,20.95 | 81.28,20.95 81.92,20.95 82.55,20.32 | 82.87,19.36 81.92,20.32 81.28,20.95 | 80.64,20.95 80.64,19.57 R43.2 | C29.1 55.96,27.3 57,28.35 57.15,28.35 57.78,28.35 58.22,28.35 | L4.P$1 75.25,26.76 C31.1 | L5.P$1 86.68,26.76 C32.1 | 68.58,15.24 68.58,4.45 JP7.1 | C28.1 47.78,28.35 48.16,28.35 48.36,28.35 | 65.48,27.3 66.33,28.16 66.52,28.35 67.06,28.35 67.67,28.35 67.74,28.35
  Bottom 0.254: v79.25,20.42 79.25,19.2 78.94,18.9 78.94,18.29 v78.94,17.98
  Bottom 0.813: v45.14,25.78 45.11,25.78 45.09,24.84 v45.09,20.32 | v55.24,25.73 v55.24,20.32 | v64.77,25.73 v64.77,20.95 | v74.93,25.09 v74.93,21.26
  Bottom 1.016: JP7.3 61.59,4.45 62.23,5.08 | JP7.5 56.52,4.45 57.15,5.08 62.23,5.08 | 62.23,5.08 66.04,5.08 66.67,4.45 JP7.1
  pour Top (isolate 0.406): 35.56,14.61 35.56,20.42 37.27,24.13 85.45,24.13 69.29,14.3
DIRECT  (via drill 0.3)
  Top 0.254: DIRECT.A JP3.16
  Top 1.016: U9.6 91.44,19.36 v91.44,21.59 | U9.7 91.44,20.63 v91.44,21.59 | U9.8 91.44,21.9 v91.44,21.59
  Bottom 1.016: JP3.16 93.34,43.9 93.34,23.5 93.34,21.59 92.71,20.32 92.71,22.86 92.08,22.23 92.08,20.32 v91.44,20.32 v91.44,21.59
EN_3V3_1  (via drill 0.3)
  Top 0.254: 36.2,33.66 v35.56,33.66 36.2,33.66 | 36.2,33.66 37.37,33.66 38.01,33.02 38.01,26.04 39.27,24.77 42.55,24.77 56.22,24.77 R41.1 59.69,28.23 59.69,30.48 59.55,30.61 U5.8
  Top 0.3: U1.7 23.57,38.66 27.18,38.66 27.74,38.1 27.74,35.66 29.11,34.29 v30.33,34.29
  Bottom 0.254: v30.33,34.29 34.29,34.29 34.92,34.29 v35.56,33.66
EN_3V3_2  (via drill 0.3)
  Top 0.254: 21.78,39.16 27.52,39.16 28.57,38.1 28.57,36.2 v29.21,35.56 | v34.92,33.02 36.47,33.02 36.73,33.02 37.37,32.38 37.37,25.4 38.64,24.13 60.33,24.13 60.96,24.77 66.67,24.77 68.36,26.45 R42.1 69.22,27.52 69.22,30.48 69.08,30.61 U6.8
  Top 0.3: U1.8 21.49,39.16 21.78,39.16
  Bottom 0.254: v29.21,35.56 29.21,34.29 29.84,33.66 33.66,33.66 34.29,33.66 v34.92,33.02
EN_3V3_M  (via drill 0.3)
  Top 0.254: v33.88,33.07 33.88,33.88 34.92,34.92 38.1,34.92 39.37,36.2 40.64,36.2 v41.91,36.2 | v46.99,40.64 47.62,41.27 48.01,41.66 | 48.01,41.66 U3.4 | R8.1 49.37,41.66 48.01,41.66
  Top 0.3: U1.6 22.36,38.16 26.46,38.16 26.61,38.16 26.98,37.8 26.98,35.36 29.26,33.07 v30.63,33.07
  Bottom 0.254: v41.91,36.2 42.55,36.2 v46.99,40.64
  Bottom 0.3: v30.63,33.07 v33.88,33.07
EN_5V_1  (via drill 0.3)
  Top 0.254: U7.9 71.89,29.34 | 71.89,29.34 71.12,28.57 71.12,26.04 69.22,24.13 61.59,24.13 60.96,23.5 38.01,23.5 36.73,24.77 36.73,30.48 36.22,31 v35.25,31 | R27.2 72.89,36.62 v71.93,35.66 | v70.41,34.75 70.41,30.83 71.89,29.34
  Top 0.3: U1.5 25.44,37.66 26.21,36.88 26.21,32.52 27.74,31 v28.44,31
  Bottom 0.254: v71.93,35.66 71.32,35.66 v70.41,34.75
  Bottom 0.3: v35.25,31 v28.44,31
EN_5V_2  (via drill 0.3)
  Top 0.254: U8.9 83.32,29.34 | 83.32,29.34 82.55,28.57 82.55,25.4 81.92,24.77 81.28,24.13 70.48,24.13 69.85,23.5 62.23,23.5 61.59,22.86 37.8,22.86 37.49,22.86 v36.58,23.77 | U1.29 9.31,39.16 v8.89,38.84 | v17.98,25.3 24.38,25.3 24.99,24.69 27.74,24.69 29.26,23.16 29.87,23.16 v30.48,23.77 | R29.2 84.47,36.62 v83.52,35.66 | v81.69,34.75 81.69,30.98 83.32,29.34
  Bottom 0.254: v8.89,38.84 11.38,38.84 11.71,38.84 12.19,38.41 12.19,28.35 14.94,25.6 17.37,25.6 v17.98,25.3 | v30.48,23.77 v36.58,23.77 | v83.52,35.66 82.6,35.66 v81.69,34.75
EN_12V  (via drill 0.3)
  Top 0.25: U14.P$3 U14.P3
  Top 0.254: v76.83,19.68 77.17,19.36 77.17,16.2 76.82,15.86 R56.2 76.14,15.81 U14.P3 | v76.2,22.23 63.5,22.23 62.87,21.59 37.47,21.59 36.63,21.59 35.36,22.86 35.36,29.7 v35.36,30
  Top 0.3: U1.4 20.75,37.16 24.87,37.16 25.3,36.73 25.3,32.36 27.33,30.33 v29.01,30.33
  Bottom 0.254: v76.83,19.68 76.83,21.59 v76.2,22.23
  Bottom 0.3: v35.36,30 34.62,30 34.29,30.33 v29.01,30.33
EN_DIRECT  (via drill 0.3)
  Top 0.254: R43.1 80,17.79 v78.41,19.68 | v76.25,23.44 76.22,23.47 76.2,23.5 71.12,23.5 70.48,22.86 62.87,22.86 62.23,22.23 37.47,22.23 36.91,22.23 36.88,22.25 v36.27,22.86 | U1.28 8.54,39.66 v8.26,39.47 | v18.8,26.04 24.56,26.04 24.69,25.91 25.3,25.3 28.04,25.3 v29.57,23.77
  Top 0.406: U9.4 83.52,17.79 R43.1
  Bottom 0.254: v78.41,19.68 78.41,21.29 v76.25,23.44 | v8.26,39.47 11.43,39.47 11.96,39.47 12.7,38.73 12.7,28.52 15.19,26.04 v18.8,26.04 | v29.57,23.77 30.18,23.16 35.97,23.16 v36.27,22.86
EN_HEAT1  (via drill 0.3)
  Top 0.254: v37.47,15.88 38.1,15.24 38.73,14.61 39.37,14.61 40.01,15.24 51.91,15.24 | 51.44,15.24 51.91,15.24 | 51.91,15.24 51.99,15.16 | 51.99,15.16 R50.2 53.3,13.94 53.98,14.61 55.09,14.61 R51.1 | 51.91,15.24 51.99,15.16 | v20.02,41.15 22.91,41.15 25.3,43.54 25.3,46.94 26.52,47.52 39.93,47.52 40.74,47.52 41.27,46.99 v41.91,46.99
  Top 0.3: U1.12 17.88,41.16 v17.88,41.3
  Bottom 0.254: v37.47,15.88 37.47,17.78 37.47,31.75 37.47,34.29 42.55,39.37 42.55,46.35 v41.91,46.99
  Bottom 0.3: v20.02,41.15 18.03,41.15 v17.88,41.3
EN_HEAT2  (via drill 0.3)
  Top 0.254: v41.27,47.93 41.07,48.13 26.21,48.13 24.38,46.94 24.38,43.54 22.76,41.91 v20.62,41.91 | v38.73,15.88 56.36,15.88 R52.2 58.38,13.94 59.05,14.61 60.17,14.61 R53.1
  Top 0.3: U1.13 16.21,41.91 v17.27,41.91
  Bottom 0.254: v38.73,15.88 38.1,16.51 38.1,19.05 38.1,34.29 43.18,39.37 43.18,46.99 42.24,47.93 v41.27,47.93
  Bottom 0.3: v17.27,41.91 v20.62,41.91
EN_HEAT3  (via drill 0.3)
  Top 0.254: v39.37,16.51 40.01,16.51 59.69,16.51 62.99,13.85 R54.2 63.47,13.94 64.14,14.61 65.25,14.61 R55.1 | v41.27,48.9 40.79,48.74 25.91,48.74 23.77,47.24 23.77,43.84 22.61,42.67 v21.08,42.67
  Top 0.3: U1.14 15.71,42.67 v16.82,42.67
  Bottom 0.254: v39.37,16.51 38.73,17.14 38.73,19.05 38.73,34.29 43.81,39.37 43.81,46.99 43.81,47.62 42.55,48.9 v41.27,48.9
  Bottom 0.3: v16.82,42.67 v21.08,42.67
EN_SC  (via drill 0.3)
  Top 0.254: U1.27 5.87,40.16 4.45,38.73 4.45,35.56 3.81,34.92 3.17,34.29 1.91,34.29 0.64,33.02 0.64,27.74 v1.07,27.3
  Top 0.3: v1.5,25.17 3.05,23.62 3.59,23.08 R31.1 | 4.51,23.47 4.42,23.47
  Top 0.406: R31.1 4.42,23.47 | 4.51,23.47 4.72,23.47 6.71,23.47 7.35,22.82 Q1.1 7.78,22.55 R35.2
  Bottom 0.254: v1.07,27.3 1.07,26.67
  Bottom 0.3: v1.5,25.17 1.22,25.45 1.07,25.6 1.07,26.67 v1.07,27.3
GND  (via drill 0.3)
  Top 0.25: U10.11 13.51,19.74 | U15.PGND4 81.16,5.38 | U15.PGND5 81.71,5.33 | 81.86,10.99 U15.P$20 82.19,14.34 | U15.PGND3 81.16,12.21 | U15.PGND2 81.71,11.83 | 12.49,38.35 12.69,38.36 U1.VSS_QFN
  Top 0.254: U1.36 8.85,35.66 8.84,35.66 8.84,36.14 v8.59,36.2 | C7.1 17.12,29.64 X1.P3 12.85,29.64 C6.1 | v64.14,31.11 U6.2 U6.9 68.58,31.11 | 69.47,31.11 69.49,31.09 | U6.10 69.41,31.61 | 69.41,31.61 69.49,31.7 | v54.61,31.11 U5.2 59.87,31.11 | U5.9 59.87,31.11 | U5.10 59.83,31.61 59.87,31.11 | U4.10 50.29,31.61 | 50.29,31.61 50.51,31.61 50.6,31.7 50.6,31.32 50.49,31.11 U4.9 U4.2 45.09,31.11 | v78.05,16.25 76.79,14.99 U14.P2 U14.P$2 | R56.1 76.09,18.51 v75.61,18.99 | v11.45,37.71 12.03,37.71 12.69,38.36 | R47.2 43.18,12.48 v43.18,12.06 | Q3.3 54.25,11.71 v54.61,12.06 | Q3.2 54.9,11.72 55.24,12.06 | Q3.1 55.55,11.85 R51.2 | Q4.3 59.33,11.71 v59.69,12.06 | Q4.2 59.98,11.72 60.33,12.06 | Q4.1 60.63,11.85 R53.2 | Q5.3 64.41,11.71 v64.77,12.06 | Q5.2 65.06,11.72 65.41,12.06 | Q5.1 65.71,11.85 R55.2 | 68.91,31.11 68.58,31.11 | 68.58,31.11 69.22,31.11 | 68.58,31.11 69.47,31.11 | 69.47,31.11 69.41,31.17 69.41,31.61 | R21.1 49.22,37.49 50.14,37.49 50.29,37.34 50.29,31.61 | U15.PGND2 81.71,9.77 U15.PGND8
  Top 0.3: 13.51,19.74 v13.25,20 | 81.16,5.38 81.25,5.29 81.68,5.29 81.71,5.33 81.75,5.29 v81.92,5.08 81.75,4.79 | U15.PGND5 81.71,7.54 U15.PGND12 U15.PGND11 U15.PGND7 U15.PGND6 U15.PGND10 82,8.83 82,9.79 81.97,9.77 U15.PGND9 | U15.PGND8 U15.PGND9 | 81.71,9.99 U15.PGND9 | 82.19,14.34 R58.1 | C47.2 C48.2 80.98,2.52 81.75,3.29 81.75,4.79 | 81.75,4.79 84.5,4.79 85.27,5.56 C39.1 85.62,6.46 C49.1 C50.1 C51.1 | 74.44,1.89 C45.2 | 16.5,18 16.5,17.5 16.49,17.51 U10.7 14.01,17.51 U10.17 | U10.V_3 13.5,17.81 13.5,19.5 | 81.16,12.21 81.25,12.29 81.71,11.83 | C35.2 10.16,11.43 v10.79,10.79
  Top 0.406: v8.1,29.36 8.26,29.41 C4.- 9.53,29.93 C5.2 | Q1.2 5.03,22.13 v5.03,20.88 | Q7.3 7.31,3.48 6.99,5.08 | Q7.2 7.29,4.13 v7.62,5.08 | Q7.1 7.92,4.79 v7.62,6.35 | 43.71,7.9 43.71,8.15
  Top 0.508: 48.97,8.89 48.16,8.53 48.01,8.38 48.01,7.92 48.01,6.25 48.31,5.94 48.31,5.79
  Top 0.813: C42.1 4.76,3.96 5.18,3.96 | 5.18,3.96 5.49,3.96 5.18,3.96 | 5.18,3.96 5.18,2.13 | 86,21 v86,22 85,22
  Bottom 0.3: v10.79,10.79 10.16,10.79
  Bottom 0.406: v8.1,29.36 7.82,29.41 | v5.03,20.88 5.03,20.12 | 30.48,6.99 30.48,5.08 | 32.38,6.99 32.38,5.08 | 33.66,6.99 33.66,5.08 | 35.56,6.99 35.56,5.08
  other vias: 11.44,40.3 1.91,17.14 3.17,17.14 67.31,8.89 67.31,7.62 38.05,10.08 62.23,6.35 62.23,9.53 62.23,10.79 59.69,13.34 57.15,10.79 57.15,9.53 57.15,6.35 18.75,15.85 18.9,19.66 16.5,18.4 81.92,2.54 83.19,3.81 83.19,5.08 8.59,34.92 11.44,36.49 6.07,28.6 12.04,21.18 81.92,3.81 83.19,2.54 84.45,2.54 5.08,19.05 5.71,17.78 6.99,18.41 57.15,13.03 62.15,13.03 67.31,13.34 67.31,12.06 67.31,10.79 62.23,7.62 57.15,7.62 88.9,4.45 87.63,3.17 88.9,3.17 87.63,4.45 84.45,5.08 6.35,6.35 6.35,5.08 6.2,0.84 7.26,0.89 6.68,1.68 6.99,3.81 12.17,27.08 13.08,26.16 74.03,39.44 71.9,37.61 74.34,36.7 74.34,34.26 74.34,31.82 71.9,33.65 61.23,38.22 61.23,36.09 61.23,33.95 61.59,28.57 62.87,28.57 64.14,28.57 62.87,31.11 61.59,31.11 51.71,38.22 51.71,36.09 51.71,33.95 50.8,28.57 52.07,28.57 52.07,31.11 85.31,39.44 83.18,37.61 85.62,36.7 85.62,34.26 85.62,31.82 83.48,39.44 83.48,33.65 53.34,31.11 53.34,28.57 54.61,28.57 40.96,33.95 42.18,33.95 41,32 41,30 41,28 43,28 41,26 42.18,35.22 40.91,35.22 44.45,44.45 44.45,40.64 43,26 45,28 70.1,29.57 70.1,28.04 71.93,27.13 71.93,25.3 73.76,25.3 83.36,27.13 83.36,25.3 49.35,7.9 51.18,8.53 72.51,39.44 75.86,39.44 84.45,3.81 81.92,1.27 83.19,1.27 84.45,1.27 87.63,1.91 88.9,1.91 80.64,1.27 78.74,1.27 77.47,1.27 76.2,1.27 76.2,2.54 43.18,10.79 43.08,8.79 49.35,8.97 64.77,13.34 54.61,13.34 44.7,5.79 46.28,5.79 47.85,5.74 43.08,7.77 41.66,7.77 41.66,8.74 53.39,33.55 62.87,33.55 44.32,33.55 25.27,3.89 27.1,3.89 28.63,3.89 34.57,4.19 34.57,1.14 27.1,2.36 28.63,2.36 49.94,48.11 51.46,48.11 52.98,48.11 52,26 61.59,26.57 53.34,41.91 59.69,41.91 63.5,41.91 68.58,41.91 74.93,41.91 80.01,41.91 85.09,41.91 80.01,39.37 80.01,36.83 91.44,41.91
  pour Bottom (isolate 0.406, rank 2): 0,50 97.83,52.63 97.83,-2.37 0,0
  pour Top (isolate 0.406, rank 2): -1.37,-2.59 0,50 97.78,51.84 98.09,-1.97
HEAT1
  Top 0.5: Q3.5 53.6,5.96 54.72,4.84 54.84,4.97 | Q3.8 55.55,5.68 54.84,4.97 | Q3.6 54.25,5.56 54.72,5.09 | 54.72,5.09 54.84,4.97 | Q3.7 54.9,5.28 54.72,5.09
  Top 1: 54.72,4.84 54.72,4.59
  Top 1.016: JP7.6 53.98,3.85 54.72,4.59
HEAT2
  Top 0.5: Q4.5 58.68,5.63 59.72,4.59 59.84,4.72 | Q4.8 60.63,5.51 59.98,4.86 | Q4.7 59.98,4.86 | 59.98,4.86 59.84,4.72 | Q4.6 59.33,5.23 59.84,4.72
  Top 1.016: JP7.4 59.05,3.94 59.72,4.59
HEAT3
  Top 0.5: Q5.5 63.76,5.55 64.41,4.9 | Q5.6 64.41,4.9 | 64.41,4.9 64.72,4.59 65.09,4.97 | Q5.8 65.71,5.59 65.09,4.97 | Q5.7 65.06,5 65.09,4.97
  Top 1.016: JP7.2 64.14,4.01 64.72,4.59
I2C_SCL
  Top 0.3: JP4.2 9.18,37.66 U1.32
I2C_SDA
  Top 0.3: JP4.1 7.14,38.16 U1.31
I_IN
  Top 0.3: C26.2 R38.1 25.5,31.19 24.59,32.11 24.59,34.7 24.23,35.05 23.13,36.16 U1.2
I_OUT  (via drill 0.3)
  Top 0.3: R40.1 C27.2 29.82,28.97 29.82,30.71 27.61,32.92 v27.43,32.92 | U1.1 22.11,35.66 23.88,33.88 v23.88,32.92
  Bottom 0.3: v27.43,32.92 v23.88,32.92
IND
  Top 0.254: U7.2 78.11,29.34 | 78.11,29.34 78.6,29.34 L4.P$2 | U7.1 77.61,28.84 78.11,29.34
IND1
  Top 0.254: 89.53,29.21 89.4,29.34 U8.2 89.03,29.34 89.53,28.84 | U8.1 89.53,28.84 | 89.53,28.84 89.97,28.84 L5.P$2
LED1
  Top 0.254: R14.2 82.53,48.96 +5V2.C
LED2
  Top 0.254: R16.2 92.69,48.96 DIRECT.C
LED5
  Top 0.254: R13.2 77.45,48.96 +5V1.C
N$1
  Top 0.254: U4.3 45.87,30.62
  Top 0.305: 45.87,30.62 45.11,29.87 43.96,29.87 L1.P$1
N$2  (via drill 0.3)
  Top 0.254: U7.5 75.84,31.64 v75.89,31.7 | R28.1 80.16,31.46 78.88,31.46 v78.64,31.7
  Bottom 0.254: v75.89,31.7 v78.64,31.7
N$3
  Top 0.254: U4.1 46.12,31.61 45.87,31.85
  Top 0.305: 46.12,31.61 45.87,31.85 45.41,32.31 L1.P$2
N$4
  Top 0.254: 26.04,7.62 L6.2
  Top 1.016: RS2.I1 35.56,6.35 34.92,5.71 27.3,5.71 26.04,6.99 26.04,7.62
N$5
  Top 0.254: C15.1 72.17,32.8 71.75,32.38 71.75,31.11 72.03,30.84 U7.6
N$6
  Top 0.254: U5.3 55.39,30.62 55.24,30.48 54.61,29.84 53.51,29.84 L2.P$1
N$7
  Top 0.254: U5.1 55.39,31.61 55.24,31.75 54.61,32.38 53.51,32.38 L2.P$2
N$8
  Top 0.1: 92.19,16.71 80.64,16.71 78.48,14.54 78.48,12.49
N$9  (via drill 0.3)
  Top 0.3: U15.P$13 83.86,7.52 v84.09,7.28 | v85.92,5.45 85.92,4.6 R62.1
  Bottom 0.3: v84.09,7.28 v85.92,5.45
N$10
  Top 0.25: U14.P4 U14.P$4
  Top 0.254: U14.P$4 74.41,13.68 Q6.4
N$11
  Top 0.254: U6.3 64.92,30.62 64.77,30.48 64.14,29.84 63.03,29.84 L3.P$1
N$12
  Top 0.254: U6.1 64.92,31.61 64.14,32.38 63.03,32.38 L3.P$2
N$13  (via drill 0.3)
  Top 0.25: U1.23 11.21,42.82 10.11,42.82 8.74,42.82 8.13,42.22 7.06,42.22 v6.6,42.67 | R1.1 5.98,45.98 JP1.1
  Bottom 0.25: v6.6,42.67 6.6,45.36 JP1.1
N$14  (via drill 0.3)
  Top 0.254: R13.1 76.19,47.26 v76.28,47.35
  Bottom 0.254: J107.2 v76.28,47.35 J107.2 | J107.2 74.8,47.35 74.93,47.47
N$15  (via drill 0.3)
  Top 0.25: U1.22 11.71,43.28 10.11,43.28 7.98,43.28 v7.82,43.13
  Bottom 0.25: v7.82,43.13 7.82,44.35 8.13,44.65 8.13,46.37 JP1.2
N$16
  Top 0.25: U1.46 15.21,33.94 X1.P1 15.53,33.62
  Top 0.3: C7.2 15.46,33.3 X1.P1
N$17
  Top 0.25: U1.45 14.71,33.69 X1.P2
  Top 0.3: C6.2 14.52,33.3 X1.P2
N$18
  Top 0.254: 5.94,40.84 5.79,40.84 3.96,39.01 3.96,36.98 DIGITAL.3
  Top 0.3: U1.25 8.9,41.16 8.59,40.84 5.94,40.84
N$19
  Top 0.3: R3.1 30.96,43.41 R4.2 32.8,43.23 U2.1
N$20
  Top 0.3: R2.1 30.83,41.61 arc90 R3.2 31.24,41.43 U2.2
N$21
  Top 0.3: R18.1 29.82,36.26 R17.2 29.82,39.07 31.53,40.78 U2.3
N$22
  Top 0.3: U2.7 38.2,41.43 R6.1 R5.2
N$23
  Top 0.3: U2.6 38.19,40.78 R6.2 R7.1
N$24
  Top 0.3: U2.5 37.02,39.19 R19.2 37.92,37.92 R20.1
N$25
  Top 0.254: R40.2 32,19.82 32.92,18.9 32.92,16.34 U11.6
N$26
  Top 0.3: 25.5,26.21 R38.2
  Top 0.305: U12.6 32.7,11.5 31.7,12.5 31.7,16.76 31.7,19.2 31.39,19.51 31.39,25.3 30.79,25.91 25.8,25.91 25.5,26.21
N$27
  Top 0.3: R54.1 63.47,10.95 Q5.4
N$28
  Top 0.254: 5.49,41.45 4.27,40.23 2.74,38.71 2.74,38.3 DIGITAL.4
  Top 0.3: 5.49,41.45 8.28,41.45 9.04,42.22 10.38,42.22 U1.24
N$29  (via drill 0.3)
  Top 0.254: v8.89,33.98 3.5,33.98 DIGITAL.2
  Top 0.3: v10.57,33.68 11.18,33.68 11.71,34.22 U1.39
  Bottom 0.3: v8.89,33.98 9.2,33.68 v10.57,33.68
N$30  (via drill 0.3)
  Top 0.254: v8.13,32.92 4.57,32.92 2.74,31.09 2.74,30.68 DIGITAL.1
  Top 0.3: v11.18,32.92 12.21,33.95 U1.40
  Bottom 0.3: v8.13,32.92 v11.18,32.92
N$31
  Top 0.3: R52.1 58.38,10.95 Q4.4
N$32
  Top 0.305: RS1.V1 34.16,14.82 U11.4
N$33
  Top 0.305: RS1.V2 34.16,15.47 U11.5
N$34
  Top 0.254: U4.11 49.09,34.83 R22.1 47.49,36.62 R21.2
N$35
  Top 0.254: U5.11 58.62,34.83 R24.1 57.02,36.62 R23.2
N$36
  Top 0.25: U1.21 12.21,43.59 12.06,43.74 10.11,43.74 6.4,43.74
  Top 0.254: 6.4,43.74 5.64,43.74 DIGITAL.5
N$37
  Top 0.3: R50.1 53.3,10.95 Q3.4
N$38
  Top 0.25: U15.P$8 79.22,7.52 78.15,6.44
  Top 0.3: 78.15,6.44 C46.2
N$39
  Top 0.254: +3V3_M.C 59.87,48.86 R10.2
N$40  (via drill 0.3)
  Top 0.254: R10.1 60.95,47.26 v61.04,47.35
  Bottom 0.254: v61.04,47.35 J110.2 59.56,47.35 59.69,47.47
  Bottom 0.305: J110.2 R10.1
N$41
  Top 0.25: U1.20 12.7,43.26 12.7,43.89 12.55,44.04 12.39,44.2 10.11,44.2 3.56,44.2 DIGITAL.6
N$42
  Top 1: C33.1 2.59,12.19 R44.1
N$43
  Top 0.254: VCC.C 54.79,48.86 R9.2
N$44  (via drill 0.3)
  Top 0.254: U8.5 87.27,31.49 v87.48,31.7 | v89.92,31.39 91.03,31.39 R30.1
  Bottom 0.254: v87.48,31.7 89.61,31.7 v89.92,31.39
N$45  (via drill 0.3)
  Top 0.254: R9.1 55.87,47.26 v55.96,47.35
  Bottom 0.254: v55.96,47.35 J111.2 54.48,47.35 54.61,47.47
  Bottom 0.305: J111.2 R9.1
N$46
  Top 0.254: R12.2 72.37,48.96 +3V3_2.C
N$47  (via drill 0.3)
  Top 0.254: R12.1 71.11,47.26 v71.2,47.35
  Bottom 0.254: J108.2 v71.2,47.35 J108.2 | J108.2 69.72,47.35 69.85,47.47
N$48
  Top 0.254: R15.2 87.61,48.96 +11V.C
N$49  (via drill 0.3)
  Top 0.254: R15.1 86.35,47.26 v86.44,47.35
  Bottom 0.254: v86.44,47.35 85.72,47.35 | 85.72,47.35 85.6,47.35 85.09,47.47 | J105.2 R15.1 85.72,47.35
N$50
  Top 0.3: U15.P$4 75.75,9.52 75.75,9.54 75.52,9.54 75.52,9.29 L7.P$2 | U15.P$5 75.52,9.02 L7.P$2 | U15.P$6 75.52,8.52 L7.P$2 | U15.P$7 75.52,8.02 75.52,8.26 L7.P$2
  Top 0.813: 78.15,8.45 75.52,8.45 75.52,8.26
  Top 1: 78.15,8.45 C46.1 78.15,8.45 | 78.15,9.29 75.52,9.29 | R57.2 78.15,8.45
N$51
  Top 0.254: R11.2 67.29,48.96 +3V3_1.C
N$52  (via drill 0.3)
  Top 0.254: 66.03,47.26 v66.12,47.35 66.12,47.26 R11.1
  Bottom 0.254: v66.12,47.35 J109.2 | J109.2 64.64,47.35 64.77,47.47 64.85,47.47 J109.2
N$53
  Top 0.3: U15.P$3 79.02,10.02 78.5,10.54 78.5,10.74 R57.1
N$54
  Top 0.3: C41.1 88.31,11.41 R59.1
N$55  (via drill 0.3)
  Top 0.254: R14.1 81.27,47.26 v81.36,47.35
  Bottom 0.254: v81.36,47.35 80.64,47.35 | 80.64,47.35 J106.2 | J106.2 79.88,47.35 80.01,47.47 | J106.2 80.64,47.35
N$56
  Top 0.3: U15.P$10 80.19,6.04 C48.1
N$57
  Top 0.3: U15.P$19 83.16,12.62 R58.2
N$58
  Top 0.25: U15.P$18 85.21,10.02
  Top 0.3: 85.21,10.02 R59.2 85.77,11.41 C40.1
N$59
  Top 0.3: U15.P$1 80.69,11.41 C38.1
N$60
  Top 0.25: U15.P$17 89.06,9.52
  Top 0.3: 89.06,9.52 R61.1 90.52,12.35 R60.2
N$61
  Top 0.254: U8.6 83.45,30.84 83.19,31.11 83.19,32.38 83.61,32.8 C19.1
N$62
  Top 0.254: U6.11 68.14,34.83 R26.1 66.54,36.62 R25.2
N$63
  Top 0.305: R47.1 44.03,12.1 U13.5
N$64  (via drill 0.3)
  Top 0.3: 6.21,20.12 Q1.3 | U10.2 13.51,14.73 v13.11,14.33 | R36.2 9.21,20.36 9.75,19.81 9.91,19.66 11.73,19.66 v11.89,19.66
  Top 0.406: 9.02,20.85 R36.2 8.41,19.93 Q1.3 | 6.21,20.12 Q1.3 | Q1.3 4.39,19.93 R32.1
  Bottom 0.3: v13.11,14.33 12.8,14.33 11.58,15.54 11.58,17.68 11.89,17.98 v11.89,19.66
N$65  (via drill 0.3)
  Top 0.406: v41.27,13.97 41.27,12.06 41.59,11.74 U13.1
  Bottom 0.406: J101.1 v41.27,13.97
N$66
  Top 0.3: STAT2.A R34.1
N$67  (via drill 0.3)
  Top 0.3: v9.45,26.21 8.64,26.21 STAT1.C
  Bottom 0.3: J103.2 10.14,25.52 v9.45,26.21
N$68  (via drill 0.3)
  Top 0.3: v9.14,23.77 8.48,24.43 STAT2.C
  Bottom 0.3: J102.2 10.11,22.81 9.45,23.47 v9.14,23.77
N$69
  Top 0.3: STAT1.A R33.1
N$70  (via drill 0.3)
  Top 0.25: U10.5 15.51,15.74
  Top 0.3: 15.51,15.74 16.25,15 16.62,14.63 22.4,14.63 22.71,14.63 23.62,15.54 23.62,19.2 23.5,19.32 v23.5,19.47 | v13.08,23.59 v23.5,23.59
  Bottom 0.3: v23.5,19.47 v23.5,23.59 | v13.08,23.59 12.01,24.65 J103.1
N$71  (via drill 0.3)
  Top 0.25: U10.3 14.01,14.24
  Top 0.3: 14.01,14.24 14.25,14 22.7,14 | v24.45,22.84 13.1,22.84 12.78,22.84 v12.65,22.71
  Top 0.305: 22.7,14 23,14.16 24.38,15.54 24.38,19.1 v24.45,19.47
  Bottom 0.3: v24.45,19.47 v24.45,22.84 | v12.65,22.71 12.32,22.55 J102.1
N$72
  Top 0.25: U10.6 17.24,17.01
  Top 0.3: 17.24,17.01 C25.1 18.03,17.53 RT3.1
N$73
  Top 0.305: U10.1 11.7,15.51 8.26,12.06 8.26,11.64 C35.1 6.83,11.43 R45.2
N$74  (via drill 0.3)
  Top 0.406: R48.2 46.14,13.55 45.72,13.97 v45.39,14.3
  Bottom 0.406: v45.39,14.3 45.09,14.48 J101.2
N$75
  Top 0.406: R48.1 47.84,11.53 C_USB.C
N$76  (via drill 0.3)
  Top 0.25: U10.14 v9.96,17.51 | C34.1 8.45,16.53 9.45,17.53 9.91,17.53 | 9.91,17.53 10.24,17.53 v9.96,17.51 | v9.96,17.51 9.92,17.51 9.91,17.53
  Top 0.305: 12.7,3.17 13.34,3.17 | 12.7,8.26 13.34,8.26 | 13.66,8.26 13.66,11.1 12.7,12.06 11.15,13.61 v11.15,13.7
  Top 0.406: Q7.5 12.7,2.83 12.7,3.17 12.7,3.48 | Q7.6 12.7,3.48 | Q7.7 12.7,4.13 | 12.7,4.13 12.7,3.48 | Q7.8 12.7,4.79 12.7,4.13 | Q2.3 12.7,8.58 12.7,8.26 12.7,7.93 | Q2.2 12.7,7.93 | Q2.1 12.7,7.28 12.7,7.93
  Top 1.27: L6.1 13.34,7.62 13.34,8.26 13.66,8.26 15.88,8.26 15.88,5.71 14.61,4.45 13.34,4.45 13.34,3.17 14.61,3.17 16.51,5.08 16.51,8.26
  Bottom 0.25: v11.15,13.7 10.99,14 10.52,14.48 10.36,14.63 | 10.06,17.41 v9.96,17.51
  Bottom 0.3: 10.36,14.63 10.36,17.1 v9.96,17.51
N$77  (via drill 0.3)
  Top 0.254: R16.1 91.43,47.26 v91.52,47.35
  Bottom 0.254: 90.17,47.47 90.68,47.35 v91.52,47.35 J104.2
N$78
  Top 0.406: P_USB.C 49.11,10.16 R49.1
N$79  (via drill 0.3)
  Top 0.406: R49.2 49.53,13.46 J100.1
  Bottom 0.406: J100.1 49.02,13.84 48.9,13.97
  other vias: 49.02,13.97
N$80  (via drill 0.3)
  Top 0.25: U10.15 10.76,17.01 10.52,17.01 v9.65,16.14
  Top 0.305: Q2.4 12.4,9.23 12.7,9.53 12.7,10.74 v10.36,13.09
  Bottom 0.25: v9.65,16.14 9.65,13.95 v10.36,13.09
N$81  (via drill 0.3)
  Top 0.25: U10.13 11.24,18.01 v11,18.25
  Top 0.305: Q7.4 7.92,2.83 7.62,2.54 7.62,1.91 8.26,1.27 16.76,1.27 19.18,3.68 19.68,4.19 19.68,10.79 19.05,11.43 14.61,11.43 v12.7,13.34
  Bottom 0.3: v11,18.25 11,15 v12.7,13.34
N$82
  Top 0.25: U10.8 15.51,18.51
  Top 0.3: 15.51,18.51 16.25,19.25 17.42,20.42 21.79,20.42 21.79,19.29 21.6,19.1 R37.2 | R39.1 R46.1 C36.2
  Top 0.305: 21.79,20.42 25.09,20.42 R39.1
N$84
  Top 0.3: D1.1 D1.2 4.71,17.18 3.9,17.98 C23.1 | U10.12 10.25,19 9.53,19
  Top 0.305: 9.53,19 8.84,19 6.99,17.14 6.99,16.45 D1.1
N$85
  Top 0.25: 8.15,14.29 C34.2 8.11,14.44
  Top 0.3: U10.16 | D1.3 7.89,13.88 C34.2
  Top 0.305: U10.16 11.42,16.5 9.53,14.61 8.62,14.61 C34.2
SC+  (via drill 0.3)
  Top 0.3: 3.88,26.43 R33.2 | R20.2 34.65,35.9 33.07,34.17 33.04,34.14
  Top 0.305: 2.86,7.64 3.15,7.64 3.17,7.62 | 33.07,34.17 33.07,32.47 33.83,31.7 33.83,24.99 33.53,24.69 33.53,24.66 v33.46,24.59
  Top 0.406: R44.2 2.13,8.53 v0.91,10.21 | v0.91,13.87 0.76,14.17 0.76,20.73 | 0.76,20.73 0.76,22.55 | 0.76,22.55 0.76,25.6 2.59,27.58 | R31.2 0.76,22.55 | R32.2 0.76,20.73 | 2.59,27.58 2.74,27.74 9.75,27.74 10.36,27.13 10.36,24.99 10.82,24.54 12.95,24.54 16.46,24.54 23.93,24.54 24.69,23.93 v26.98,23.93 | R33.2 R34.2 | 3.88,26.43 2.72,27.58 2.59,27.58 | Q2.5 7.62,9.23 7.62,8.89 | Q2.6 7.62,8.58 | 7.62,8.58 7.62,8.89 | Q2.7 7.62,7.93 | 7.62,7.93 7.62,8.58 | Q2.8 7.62,7.28 7.62,7.93 | 7.62,7.93 7.62,8.26 6.99,8.89 7.62,8.89 | 7.62,8.89 7.14,8.89 R45.1
  Top 1: 2.54,7.15 R44.2
  Top 1.27: 6.99,7.62 6.99,8.26 | JP5.2 R44.2 2.86,7.64 | C42.2 2.86,7.64 | 2.86,7.64 5.54,7.64 R45.1
  Top 1.422: 3.17,7.62 6.99,7.62
  Bottom 0.406: v0.91,10.21 v0.91,13.87 | v26.98,23.93 27.79,24.59 v33.46,24.59
TS  (via drill 0.3)
  Top 0.3: RT3.2 22.25,17.53 v23.01,16.76 22.25,16 RT4.1 | U10.4 15.09,14.94 v15.24,14.94 | 16.92,13.11 v16.92,13.26 16.92,13.11 | 20.42,13.11 21.79,13.11 | 20.73,13.11 20.42,13.11 | 21.64,13.11 21.79,13.11 | 21.79,13.11 21.34,13.11 | 21.79,13.11 v22.71,13.11 | 20.42,13.11 16.92,13.11
  Top 0.305: v22.71,13.11 22.86,12.95 22.86,4.45 26.09,1.22 30.48,1.22 RTH.2
  Bottom 0.3: v22.71,13.11 23.01,13.41 v23.01,16.76 | v15.24,14.94 16.61,13.56 v16.92,13.26
V_BAT  (via drill 0.3)
  Top 0.3: U1.9 21.88,39.66 21.37,39.66 | v27.89,45.11 C1.2 R4.1
  Top 0.305: 21.88,39.66 22.28,39.66 24.08,41.45 25.91,43.28 25.91,44.96 v26.06,45.11
  Bottom 0.3: v26.06,45.11 26.82,45.11 v27.89,45.11
V_BAT+
  Top 0.25: U10.9 14.51,20.64
  Top 0.3: 14.51,20.64 C24.1
  Top 0.305: C24.1 15.21,21.34 27.74,21.34 28.3,20.77 28.3,14.68 31.09,11.89 31.39,11.58 31.7,11.28 31.7,9.14 32,8.84 32.67,8.84 U12.5 32.73,8.84 33.53,8.84 34.16,9.47 RS2.V2
V_SC  (via drill 0.3)
  Top 0.3: R5.1 C3.2 | R5.1 39.61,46.14 arc-90 39.75,46 | U1.3 23.93,36.66 | 23.93,36.66 v24.46,36.35 23.93,36.66 | R5.1 38.38,46.48 27.28,46.48 26.98,46.18 26.98,43.28 25.76,42.06 v24.38,40.69
  Bottom 0.3: v24.38,40.69 24.46,40.61 v24.46,36.35
V_SCOUT  (via drill 0.3)
  Top 0.25: U10.10 14.01,20.34
  Top 0.3: 14.01,20.34 C24.2 13.26,21.51 13.75,22 28.04,22
  Top 0.305: v28.96,13.11 28.96,8.23 29.87,7.32 31.09,7.32 31.39,7.62 RS2.V1 33.56,8.22 U12.4 | v28.96,14.94 28.96,21.09 28.04,22
  Bottom 0.305: v28.96,13.11 28.96,14.02 v28.96,14.94
V_USB
  Top 0.406: 44.42,9.8 U13.4 44.7,10.16 P_USB.A | C_USB.A P_USB.A | 46.35,10.04 P_USB.A
  Top 0.508: 44.42,9.8 44.81,7.92 MINI_USB.1

## Text on the board
tNames: TST | AGND | RST | A8 | A5 | A4 | A11 | A10 | A9 | TX | G | G | G | G | G | G | G | G | G | G | RX | SDA | SCL | L1 | L2 | L3 | L4 | L5 | Octanis Rover EPS v2.0 | RS1 | www.octanis.org | RS2 | L7 | SC+ | GND | GND | VBAT
bNames: TST | RST | DIR G 11 G 5.2 G 5.1 G 3.2 G 3.1 G 3M G VCC G | SDA | Electrical Power Subsystem | Octanis Rover EPS v2.0 | SCL | G SC+ | BAT G G RTBAT | BAT H3 BAT H2 BAT H1 | www.octanis.org